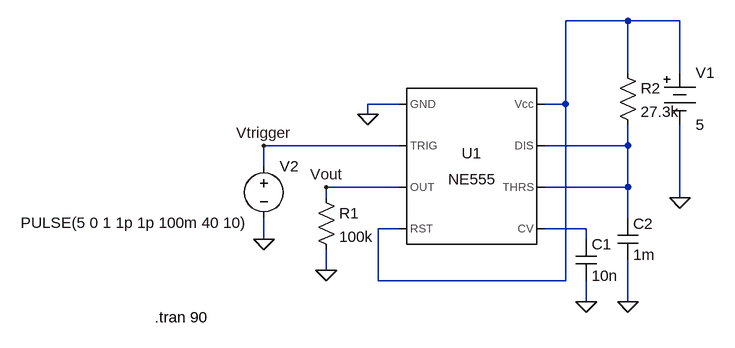
[diagram p0: schematic 3_12_pablo_gomez_tp7_ej2.asc]
3_12_pablo_gomez_tp7_ej2.asc, the LTspice schematic file:
Version 4
SHEET 1 880 680
WIRE 432 -64 336 -64
WIRE 512 -64 432 -64
WIRE 432 16 432 -64
WIRE 512 16 512 -64
WIRE 80 64 32 64
WIRE 336 64 336 -64
WIRE 336 64 304 64
WIRE 32 80 32 64
WIRE 80 128 -128 128
WIRE 432 128 432 96
WIRE 432 128 304 128
WIRE -128 160 -128 128
WIRE 80 192 -32 192
WIRE 432 192 432 128
WIRE 432 192 304 192
WIRE -32 208 -32 192
WIRE 512 208 512 96
WIRE 432 240 432 192
WIRE 80 256 48 256
WIRE 368 256 304 256
WIRE -128 272 -128 240
WIRE 368 272 368 256
WIRE -32 320 -32 288
WIRE 48 336 48 256
WIRE 336 336 336 64
WIRE 336 336 48 336
WIRE 368 368 368 336
WIRE 432 368 432 304
FLAG 32 80 0
FLAG 512 208 0
FLAG -128 272 0
FLAG -32 320 0
FLAG -32 192 Vout
FLAG 368 368 0
FLAG -128 128 Vtrigger
FLAG 432 368 0
SYMBOL Misc\\NE555 192 160 R0
SYMATTR InstName U1
SYMBOL Misc\\battery 512 0 R0
WINDOW 123 0 0 Left 0
WINDOW 39 0 0 Left 0
SYMATTR InstName V1
SYMATTR Value 5
SYMBOL voltage -128 144 R0
WINDOW 3 -374 103 Left 2
WINDOW 123 0 0 Left 0
WINDOW 39 0 0 Left 0
SYMATTR Value PULSE(5 0 1 1p 1p 100m 40 10)
SYMATTR InstName V2
SYMBOL res -48 192 R0
SYMATTR InstName R1
SYMATTR Value 100k
SYMBOL cap 352 272 R0
SYMATTR InstName C1
SYMATTR Value 10n
SYMBOL res 416 0 R0
SYMATTR InstName R2
SYMATTR Value 27.3k
SYMBOL cap 416 240 R0
SYMATTR InstName C2
SYMATTR Value 1m
TEXT -296 392 Left 2 !.tran 90

The netlist it stands for:
* 3_12_pablo_gomez_tp7_ej2.asc
XU1 0 Vtrigger Vout N001 N003 N002 N002 N001 NE555  ; pins GND TRIG OUT RST CV THRS DIS Vcc
V1 N001 0 5
V2 Vtrigger 0 PULSE(5 0 1 1p 1p 100m 40 10)
R1 Vout 0 100k
C1 N003 0 10n
R2 N001 N002 27.3k
C2 N002 0 1m
.tran 90
.lib NE555.sub
.backanno
.end